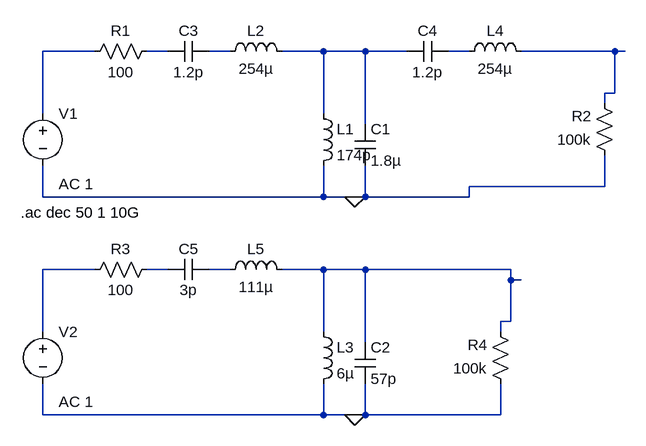
[diagram p0: schematic freq-bpf-9Mhz-chebysev.asc]
freq-bpf-9Mhz-chebysev.asc, the LTspice schematic file:
Version 4
SHEET 1 880 680
WIRE -208 64 -288 64
WIRE -96 64 -128 64
WIRE 0 64 -32 64
WIRE 144 64 80 64
WIRE 208 64 144 64
WIRE 272 64 208 64
WIRE 368 64 336 64
WIRE 592 64 448 64
WIRE 608 64 592 64
WIRE 592 128 592 64
WIRE 592 128 576 128
WIRE 576 144 576 128
WIRE -288 160 -288 64
WIRE 144 160 144 64
WIRE 208 176 208 64
WIRE 576 272 576 224
WIRE 576 272 368 272
WIRE -288 288 -288 240
WIRE 144 288 144 240
WIRE 144 288 -288 288
WIRE 192 288 144 288
WIRE 208 288 208 240
WIRE 208 288 192 288
WIRE 368 288 368 272
WIRE 368 288 208 288
WIRE -208 400 -288 400
WIRE -96 400 -128 400
WIRE 0 400 -32 400
WIRE 144 400 80 400
WIRE 208 400 144 400
WIRE 432 400 208 400
WIRE 432 416 432 400
WIRE 448 416 432 416
WIRE 432 480 432 416
WIRE 432 480 416 480
WIRE -288 496 -288 400
WIRE 144 496 144 400
WIRE 416 496 416 480
WIRE 208 512 208 400
WIRE -288 624 -288 576
WIRE 144 624 144 576
WIRE 144 624 -288 624
WIRE 192 624 144 624
WIRE 208 624 208 576
WIRE 208 624 192 624
WIRE 416 624 416 576
WIRE 416 624 208 624
FLAG 192 288 0
FLAG 192 624 0
SYMBOL ind 128 144 R0
SYMATTR InstName L1
SYMATTR Value 174p
SYMBOL ind -16 80 R270
WINDOW 0 32 56 VTop 2
WINDOW 3 5 56 VBottom 2
SYMATTR InstName L2
SYMATTR Value 254µ
SYMBOL cap 192 176 R0
SYMATTR InstName C1
SYMATTR Value 1.8µ
SYMBOL cap -32 48 R90
WINDOW 0 0 32 VBottom 2
WINDOW 3 32 32 VTop 2
SYMATTR InstName C3
SYMATTR Value 1.2p
SYMBOL voltage -288 144 R0
WINDOW 123 24 124 Left 2
WINDOW 39 0 0 Left 0
SYMATTR InstName V1
SYMATTR Value ""
SYMATTR Value2 AC 1
SYMBOL res -112 48 R90
WINDOW 0 0 56 VBottom 2
WINDOW 3 32 56 VTop 2
SYMATTR InstName R1
SYMATTR Value 100
SYMBOL res 592 240 R180
WINDOW 0 36 76 Left 2
WINDOW 3 36 40 Left 2
SYMATTR InstName R2
SYMATTR Value 100k
SYMBOL ind 352 80 R270
WINDOW 0 32 56 VTop 2
WINDOW 3 5 56 VBottom 2
SYMATTR InstName L4
SYMATTR Value 254µ
SYMBOL cap 336 48 R90
WINDOW 0 0 32 VBottom 2
WINDOW 3 32 32 VTop 2
SYMATTR InstName C4
SYMATTR Value 1.2p
SYMBOL ind 128 480 R0
SYMATTR InstName L3
SYMATTR Value 6µ
SYMBOL ind -16 416 R270
WINDOW 0 32 56 VTop 2
WINDOW 3 5 56 VBottom 2
SYMATTR InstName L5
SYMATTR Value 111µ
SYMBOL cap 192 512 R0
SYMATTR InstName C2
SYMATTR Value 57p
SYMBOL cap -32 384 R90
WINDOW 0 0 32 VBottom 2
WINDOW 3 32 32 VTop 2
SYMATTR InstName C5
SYMATTR Value 3p
SYMBOL voltage -288 480 R0
WINDOW 123 24 124 Left 2
WINDOW 39 0 0 Left 0
SYMATTR InstName V2
SYMATTR Value ""
SYMATTR Value2 AC 1
SYMBOL res -112 384 R90
WINDOW 0 0 56 VBottom 2
WINDOW 3 32 56 VTop 2
SYMATTR InstName R3
SYMATTR Value 100
SYMBOL res 432 592 R180
WINDOW 0 36 76 Left 2
WINDOW 3 36 40 Left 2
SYMATTR InstName R4
SYMATTR Value 100k
TEXT -322 312 Left 2 !.ac dec 50 1 10G

The netlist it stands for:
* freq-bpf-9Mhz-chebysev.asc
L1 N004 0 174p
L2 N003 N004 254µ
C1 N004 0 1.8µ
C3 N003 N002 1.2p
V1 N001 0 AC 1
R1 N002 N001 100
R2 0 N006 100k
L4 N005 N006 254µ
C4 N005 N004 1.2p
L3 N010 0 6µ
L5 N009 N010 111µ
C2 N010 0 57p
C5 N009 N008 3p
V2 N007 0 AC 1
R3 N008 N007 100
R4 0 N010 100k
.ac dec 50 1 10G
.backanno
.end